# Altium project AeroBoard.PrjPcb
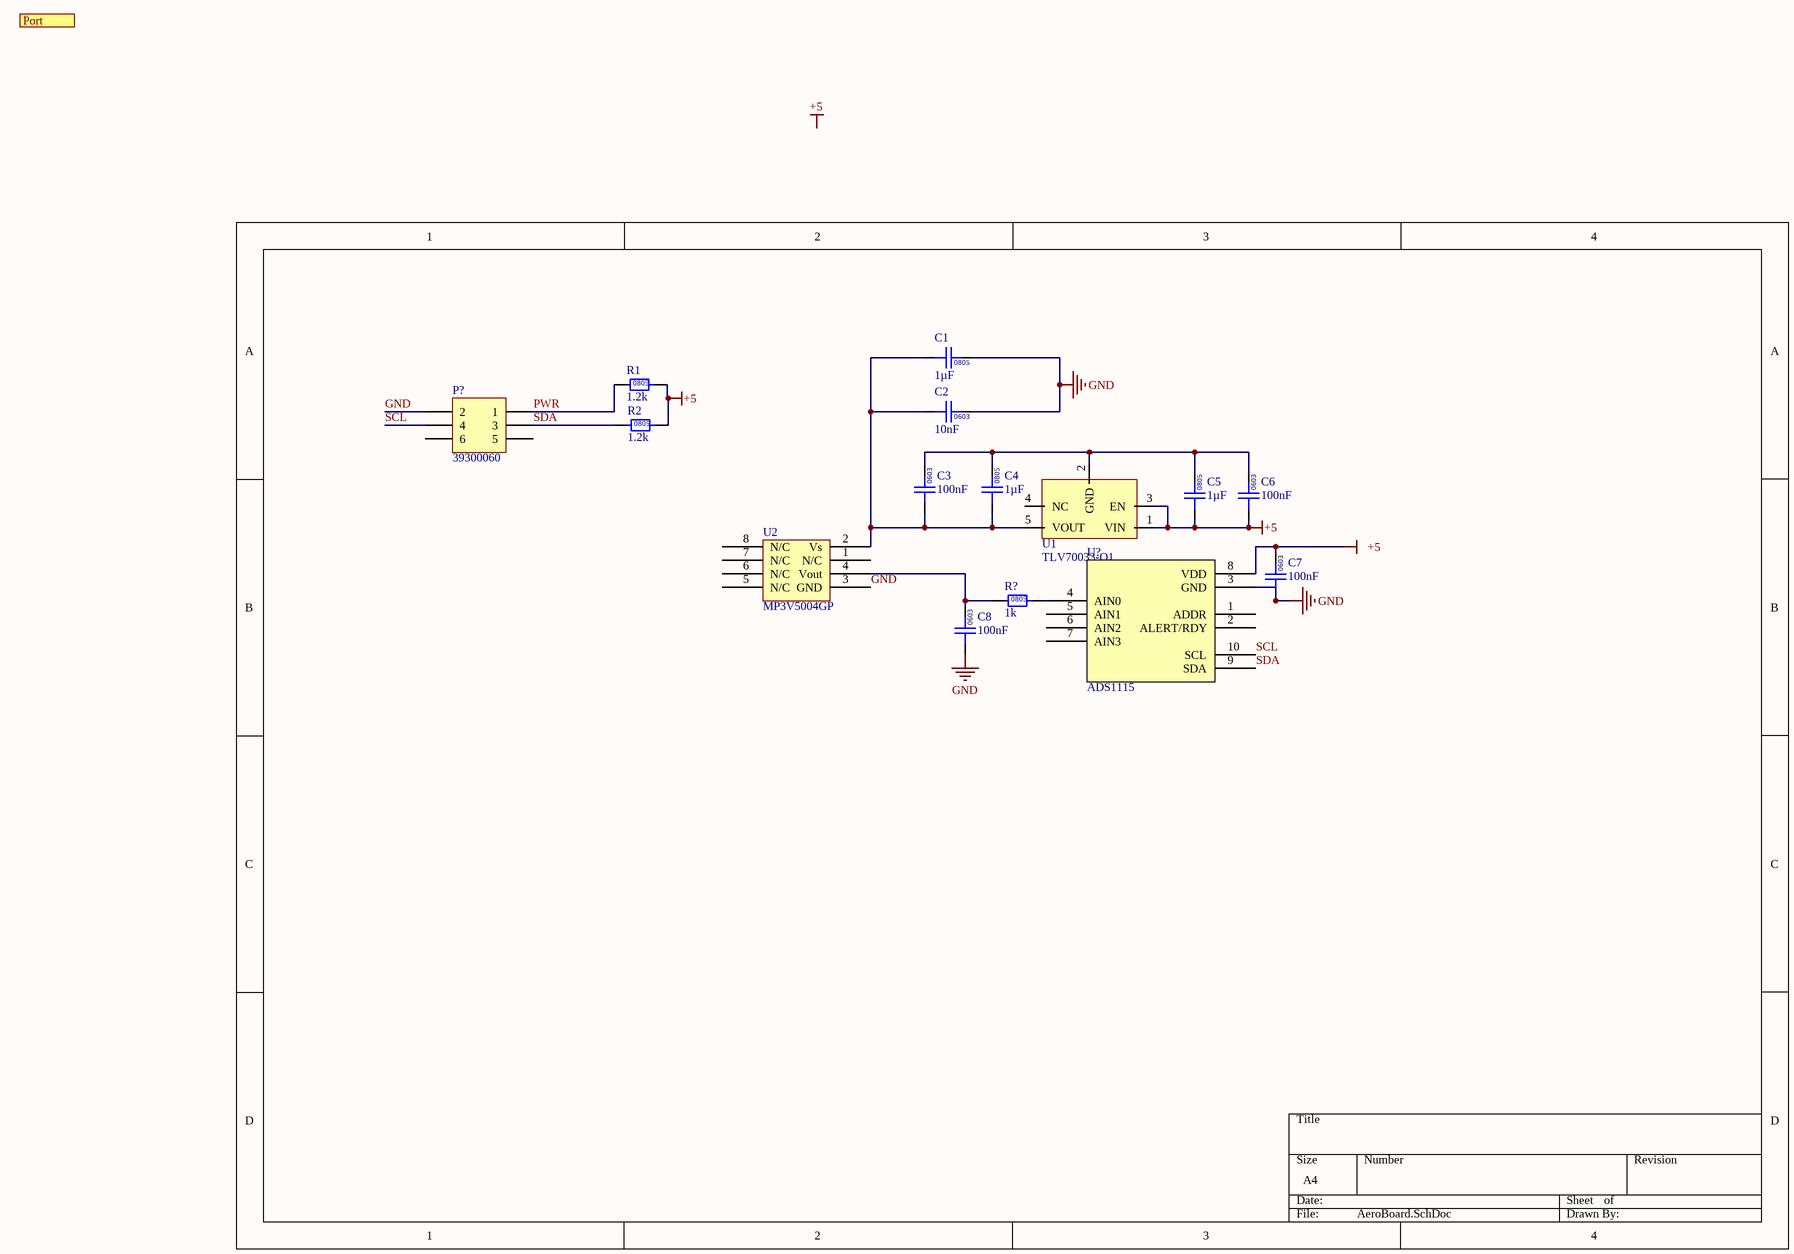
[diagram p0: AeroBoard.SchDoc]
1 sheet, 15 parts. Net scope: flat (ports and power ports of the same name join across sheets).
Board file: AeroBoard.PcbDoc

## Sheet AeroBoard.SchDoc
size A4; SheetNumber: 1; SheetTotal: 1

### Parts
C1  1µF  [0805]
C2  10nF  [0603]
C3  100nF  [0603]
C4  1µF  [0805]
C5  1µF  [0805]
C6  100nF  [0603]
C7  100nF  [0603]
C8  100nF  [0603]
P?  39300060  [39300060]
R1  1.2k  [0805]
R2  1.2k  [0805]
R?  1k  [0805]
U1  TLV70033-Q1  [TI SOT-23-5]
U2  MP3V5004GP
U?  ADS1115  [TI 10-VSSOP]

### Ports
Port

### Nets
   +5: C5.1 C6.1 C7.2 R1.2 R2.2 U1.1(VIN) U1.3(EN) U?.8(VDD)  [also labelled +5]
GND: C1.2 C2.2 C7.1 C8.1 P?.2 U2.3(GND) U?.3(GND)
PWR: P?.1 R1.1
SCL: P?.4 U?.10(SCL)
SDA: P?.3 R2.1 U?.9(SDA)
NetC1_1: C1.1 C2.1 C3.1 C4.1 U1.5(VOUT) U2.2(Vs)
NetC3_2: C3.2 C4.2 C5.2 C6.2 U1.2(GND)
NetC8_2: C8.2 R?.1 U2.4(Vout)
NetR?_2: R?.2 U?.4(AIN0)

Not connected (* = marked no-connect by the designer): P? 5 6; U1 4(NC); U2 1(N/C) 5(N/C) 6(N/C) 7(N/C) 8(N/C); U? 1(ADDR) 2(ALERT/RDY) 5(AIN1) 6(AIN2) 7(AIN3)

### Notes on the sheet
- Labels drawn without touching a wire or pin: +5
- (in symbol GCM21BR71H105KA03L) 0805
- (in symbol GCM188L81H103KA03D) 0603
- (in symbol GCM188L81H104KA57D) 0603
- (in symbol RC0805FR071K2L) 0805
- (in symbol RC0805FR071KL) 0805

### Library data of the parts
C1 C4 C5 = GCM21BR71H105KA03L: Manufacturer: muRata; Rated Voltage: 50V; Tolerance: ±10%; Material: MLCC; Temperature Rating: X7R; Part Number: GCM21BR71H105KA03L; Value: 1µF; Digikey Part Number: 490-10675-1-ND
C2 = GCM188L81H103KA03D: Manufacturer: muRata; Rated Voltage: 50V; Tolerance: ±10%; Material: MLCC; Temperature Rating: X8L; Part Number: GCM188L81H103KA03D; Value: 10nF; Digikey Part Number: 490-GCM188L81H103KA03DCT-ND
C3 C6-C8 = GCM188L81H104KA57D: Manufacturer: muRata; Rated Voltage: 50V; Tolerance: ±10%; Material: MLCC; Temperature Rating: X8L; Part Number: GCM188L81H104KA57D; Value: 100nF; Digikey Part Number: 490-6049-1-ND
P? = 39300060: Pitch: 4.2mm; Row Spacing: 5.5mm; Angle: 90; Flange: No; Contact: Tin; Part Number: 39300060; Positions: 6; Digikey Part Number: WM21353-ND
R1 R2 = RC0805FR071K2L: Manufacturer: YAGEO; Tolerance: 0.01; Rated Power: 0.125W; Part Number: RC0805FR071K2L; Value: 1.2k; Material: FR-07; Digikey Part Number: 311-1.20KCRCT-ND
R? = RC0805FR071KL: Manufacturer: YAGEO; Tolerance: 0.01; Rated Power: 0.125W; Part Number: RC0805FR071KL; Value: 1k; Material: FR-07; Digikey Part Number: 311-1.00KCRCT-ND
U1 = TLV70033-Q1: IC REG LINEAR 3.3V 200MA SOT23-5; Manufacturer: Texas Instruments; Input Voltage: 2 to 5.5 V; Output Current: 0.2 A; Part Number: TLV70033-Q1; Output Voltage: 3.3 V; Digikey Part Number: 296-27780-1-ND
U? = ADS1115: 16 Bit Analog to Digital Converter 2, 4 Input 1 Sigma-Delta 10-VSSOP; Manufacturer: Texas Instruments; Complex IC: 1; Part Number: ADS1115; Digikey Part Number: 296-38849-1-ND